# EAGLE design amp (EAGLE 5.11)
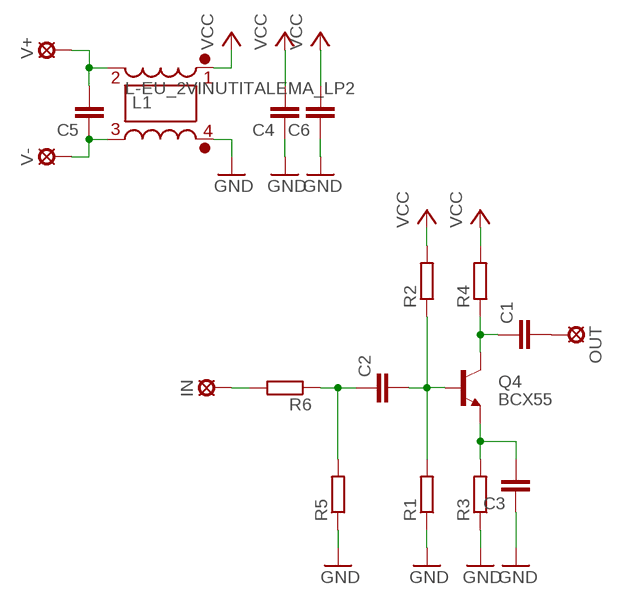
[diagram p0: schematic, sheet 1]

## Parts
C1  C-EUC1206  [C1206]
C2  C-EUC1206  [C1206]
C3  C-EUC1206  [C1206]
C4  C-EUC1206  [C1206]
C5  C-EUC1206  [C1206]
C6  C-EUC1206  [C1206]
IN  SP3X5SP3X5  [SP3X5]
L1  L-EU_2VINUTITALEMA_LP2  [TALEMA_LP2]
OUT  SP3X5SP3X5  [SP3X5]
Q4  BCX55  [SOT89]
R1  R-EU_R1206  [R1206]
R2  R-EU_R1206  [R1206]
R3  R-EU_R1206  [R1206]
R4  R-EU_R1206  [R1206]
R5  R-EU_R1206  [R1206]
R6  R-EU_R1206  [R1206]
V+  SP3X5SP3X5  [SP3X5]
V-  SP3X5SP3X5  [SP3X5]

## Nets
GND: C3.1 C4.1 C6.1 L1.4 R1.1 R3.1 R5.1
N$1: C2.2 Q4.1(B) R1.2 R2.1
N$2: C1.1 Q4.2(C) R4.1
N$4: C1.2 OUT.BO(MP)
N$5: C3.2 Q4.3(E) R3.2
N$7: C2.1 R5.2 R6.1
N$8: C5.1 L1.3 V-.BO(MP)
N$9: C5.2 L1.2 V+.BO(MP)
N$10: IN.BO(MP) R6.2
VCC: C4.2 C6.2 L1.1 R2.2 R4.2

## Library data of the parts
C1-C6 = rcl:C-EU: CAPACITOR, European symbol
IN OUT V+ V- = solpad:SP3X5
L1 = rcl:L-EU_2VINUTI
Q4 = transistor-npn:BCX55
R1-R6 = rcl:R-EU_: RESISTOR, European symbol

## Board
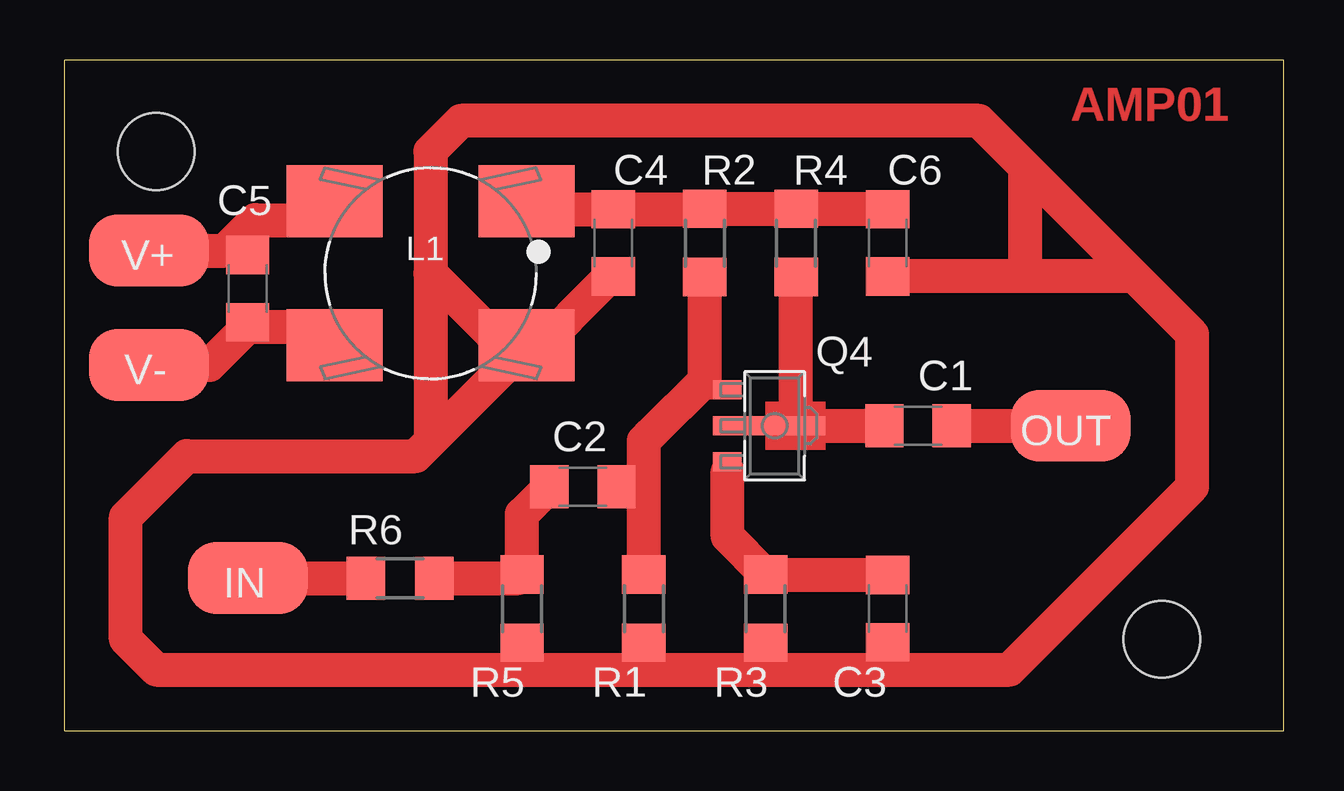
[diagram p1: board, top side]

Size 50.8 x 27.94 mm. Coordinates in mm from the lower left corner, seen from the top.
Outline: 0,0 50.8,0 50.8,27.94 0,27.94 0,0
Copper layers (1*16): Top 0.035mm / dielectric 1.5mm / Bottom 0.035mm
Design rules "default": minimum track width 10mil, minimum drill 24mil, track to track 8mil, track to pad 8mil, pad to pad 8mil, via to via 8mil, smd to smd 8mil, copper to edge 40mil, drill to drill 8mil, minimum pad ring 10mil, minimum via ring 8mil, stop-mask expansion 4mil, vias tented up to drill 0mil, thermal gap 10mil
Holes 3.2 mm at 45.72,3.81 3.81,24.13

### Footprints (pad centres in the part's own frame; a part is rotated, then mirrored left to right if it is on the bottom)
C1206 = smd 1.6 x 1.8: 1 -1.4,0; 2 1.4,0
SP3X5 = smd 3 x 5: BO 0,0
TALEMA_LP2 = smd 3 x 4: 1 -3,4; 2 -3,-4; 3 3,-4; 4 3,4
SOT89 = smd 0.8 x 1.2: 1 -1.5,-1.6; 3 1.5,-1.6 | smd 0.8 x 4.7: 2 0,0.15
R1206 = smd 1.6 x 1.803: 1 -1.422,0; 2 1.422,0

### Placement (x,y rotation side)
C1  35.56,12.7 0 top
C2  21.59,10.16 0 top
C3  34.29,5.08 90 top
C4  22.86,20.32 90 top
C5  7.62,18.41 90 top
C6  34.29,20.32 90 top
IN  7.62,6.35 90 top
L1  15.24,19.05 270 top
OUT  41.91,12.7 90 top
Q4  29.21,12.7 270 top
R1  24.13,5.08 90 top
R2  26.67,20.32 90 top
R3  29.21,5.08 90 top
R4  30.48,20.32 90 top
R5  19.05,5.08 90 top
R6  13.97,6.35 180 top
V+  3.49,20 90 top
V-  3.49,15.24 90 top

### Tracks (layer width: path | path; a pad name or v marks a point on that pad's centre or on a via)
GND
  Top 1.422: C4.1 22.73,18.92 19.37,15.56 L1.4 14.62,11.43 5.08,11.43 2.54,8.89 2.54,3.81 3.81,2.54 19.05,2.54 | 19.05,2.54 24.13,2.54 | 24.13,2.54 29.21,2.54 | 29.21,2.54 34.29,2.54 | 34.29,2.54 39.37,2.54 46.99,10.16 46.99,16.51 44.58,18.92 44.45,18.92 | 44.45,18.92 C6.1 | 19.05,2.54 R5.1 | 24.13,2.54 R1.1 | 29.21,2.54 R3.1 | 34.29,2.54 C3.1 | 19.05,16.51 17.78,16.51 15.24,19.05 | 15.24,19.05 15.24,24.13 16.51,25.4 38.1,25.4 40.01,23.5 | 40.01,23.5 44.45,19.05 44.45,18.92 | 15.24,19.05 15.24,12.06 | 40.01,23.5 40.01,19.05
N$1
  Top 0.813: Q4.1 26.27,14.2 24.45,12.38
  Top 1.422: R2.1 26.67,14.61 24.45,12.38 24.13,12.06 24.13,10.16 | R1.2 24.13,10.16 | 24.13,10.16 C2.2
N$2
  Top 0.813: Q4.2 30.48,12.7
  Top 1.422: R4.1 30.48,12.7 C1.1
N$4
  Top 1.422: C1.2 OUT.BO
N$5
  Top 0.813: Q4.3 27.62,10.87 27.62,10.79
  Top 1.422: C3.2 34.27,6.5 R3.2 27.62,8.09 27.62,10.79
N$7
  Top 1.422: C2.1 19.05,9.02 R5.2 18.9,6.35 R6.1
N$8
  Top 1.422: V-.BO 6.03,15.24 7.62,16.83 | 7.62,16.83 10.43,16.83 L1.3 | 7.62,16.83 C5.1
N$9
  Top 1.422: 7.94,21.27 10.43,21.27 L1.2 | V+.BO 6.67,20 7.94,21.27 | 7.94,21.27 C5.2
N$10
  Top 1.422: IN.BO R6.2
VCC
  Top 1.422: L1.1 20.84,21.72 C4.2 26.65,21.72 R2.2 R4.2 34.27,21.74 C6.2

### Text on the board
Top: AMP01
Measures: 50 | 28